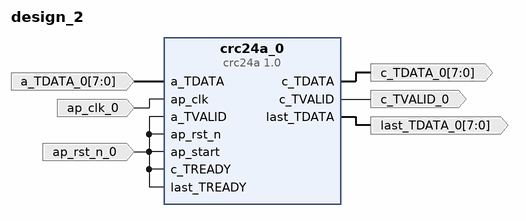
[diagram p0: block diagram of the top level]
# Vivado block design design_2, xc7z020clg484-1, Vivado 2022.2.2
create_bd_design design_2

create_bd_port -dir I -type clk ap_clk_0
create_bd_port -dir I -type rst ap_rst_n_0
create_bd_port -dir O -from 7 -to 0 last_TDATA_0
create_bd_port -dir O -from 7 -to 0 c_TDATA_0
create_bd_port -dir O c_TVALID_0
create_bd_port -dir I -from 7 -to 0 a_TDATA_0

create_bd_cell -type ip -vlnv xilinx.com:hls:crc24a:1.0 crc24a_0

# ---- connections ----

connect_bd_net -net a_TDATA_0_1 [get_bd_ports a_TDATA_0] [get_bd_pins crc24a_0/a_TDATA]
connect_bd_net -net ap_clk_0_1 [get_bd_ports ap_clk_0] [get_bd_pins crc24a_0/ap_clk]
connect_bd_net -net ap_rst_n_0_1 [get_bd_ports ap_rst_n_0] \
  [get_bd_pins crc24a_0/ap_rst_n] [get_bd_pins crc24a_0/ap_start] [get_bd_pins crc24a_0/a_TVALID] \
  [get_bd_pins crc24a_0/c_TREADY] [get_bd_pins crc24a_0/last_TREADY]
connect_bd_net [get_bd_pins crc24a_0/c_TDATA] [get_bd_ports c_TDATA_0]
connect_bd_net [get_bd_pins crc24a_0/c_TVALID] [get_bd_ports c_TVALID_0]
connect_bd_net [get_bd_pins crc24a_0/last_TDATA] [get_bd_ports last_TDATA_0]

validate_bd_design
save_bd_design
